# Altium schematic sheet EN_Boot_Buttons.SchDoc
size A; SheetNumber: 3; SheetTotal: 4
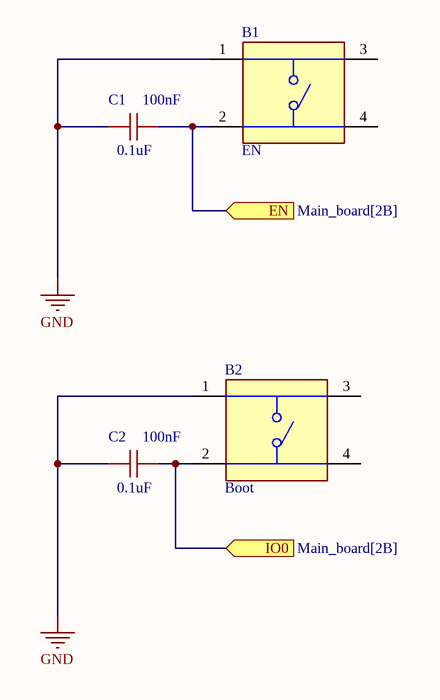
[diagram p0: EN_Boot_Buttons.SchDoc]

## Parts
B1  EN  [SW_TS04-66-43-BK-100-SMT]
B2  Boot  [SW_TS04-66-43-BK-100-SMT]
C1  100nF  [CAPC2013X140X45ML15T25]
C2  100nF  [CAPC2013X140X45ML15T25]

## Ports
EN (in, see Main_board[2B]), IO0 (in, see Main_board[2B])

## Nets
GND: B1.1 B2.1 C1.1 C2.1
EN: B1.2 C1.2 ; port EN
IO0: B2.2 C2.2 ; port IO0

Not connected (* = marked no-connect by the designer): B1 3 4; B2 3 4

## Notes on the sheet
- (in symbol GCM21BR71E104KA37L) 0.1uF

## Library data of the parts
B1 B2 = TS04-66-50-BK-160-SMT-TR_1: 6 x 6 mm, 5 mm Actuator Height, 160 gf, Black, Surface Mount, SPST, Tactile Switch; Manufacturer: Same Sky; Number of Positions: 2; Supplier: DigiKey; Supplier Part Number: 2223-TS04-66-50-BK-160-SMT-TR-ND; Manufacturer Part Number: TS04-66-50-BK-160-SMT-TR; RoHS: Compliant; Category: Tactile Switches; Pricing: 5000=0.10735 (USD); Lifecycle Status: Production; REACH SVHC: Yes; ComponentLink1URL: https://datasheet.octopart.com:443/TS04-66-50-BK-160-SMT-TR-Same-Sky-datasheet-183540778.pdf?src-supplier=Same+Sky; ComponentLink1Description: https://datasheet.octopart.com:443/TS04-66-50-BK-160-SMT-TR-Same-Sky-datasheet-183540778.pdf?src-supplier=Same+Sky; ComponentLink2URL: https://datasheet.octopart.com:443/TS04-66-50-BK-160-SMT-TR-Same-Sky-datasheet-181920469.pdf?src-supplier=Same+Sky; ComponentLink2Description: https://datasheet.octopart.com:443/TS04-66-50-BK-160-SMT-TR-Same-Sky-datasheet-181920469.pdf?src-supplier=Same+Sky; ComponentLink3URL: https://datasheet.octopart.com:443/TS04-66-50-BK-160-SMT-TR-CUI-Devices-datasheet-175928975.pdf?src-supplier=Same+Sky; ComponentLink3Description: https://datasheet.octopart.com:443/TS04-66-50-BK-160-SMT-TR-CUI-Devices-datasheet-175928975.pdf?src-supplier=Same+Sky; ComponentLink4URL: https://datasheet.octopart.com:443/TS04-66-50-BK-160-SMT-TR-CUI-Devices-datasheet-155929909.pdf?src-supplier=Same+Sky; ComponentLink4Description: https://datasheet.octopart.com:443/TS04-66-50-BK-160-SMT-TR-CUI-Devices-datasheet-155929909.pdf?src-supplier=Same+Sky; ComponentLink5URL: https://datasheet.octopart.com:443/TS04-66-50-BK-160-SMT-TR-CUI-Devices-datasheet-180438940.pdf?src-supplier=IHS; ComponentLink5Description: https://datasheet.octopart.com:443/TS04-66-50-BK-160-SMT-TR-CUI-Devices-datasheet-180438940.pdf?src-supplier=IHS; ComponentLink6URL: https://datasheet.octopart.com:443/TS04-66-50-BK-160-SMT-TR-Same-Sky-datasheet-182881590.pdf?src-supplier=Master+Electronics; ComponentLink6Description: https://datasheet.octopart.com:443/TS04-66-50-BK-160-SMT-TR-Same-Sky-datasheet-182881590.pdf?src-supplier=Master+Electronics; ComponentLink7URL: https://datasheet.octopart.com:443/TS04-66-50-BK-160-SMT-TR-Same-Sky-datasheet-189105765.pdf?src-supplier=Master+Electronics; ComponentLink7Description: https://datasheet.octopart.com:443/TS04-66-50-BK-160-SMT-TR-Same-Sky-datasheet-189105765.pdf?src-supplier=Master+Electronics; ComponentLink8URL: https://datasheet.octopart.com:443/TS04-66-50-BK-160-SMT-TR-Same-Sky-datasheet-188930959.pdf?src-supplier=TME; ComponentLink8Description: https://datasheet.octopart.com:443/TS04-66-50-BK-160-SMT-TR-Same-Sky-datasheet-188930959.pdf?src-supplier=TME; ComponentLink9URL: https://octopart.com:443/opatz8j6/c1?t=AHJHVxjaiIDIr6H_ItDqsJeDJqxcW_gJHqcHV2sr14xMipfx-HDzg_f0vkasGYHy5q-Btyt4jzHIYsIXAp8M-MkPAGFwjUVKwjpKunO9EjmQ9NoVu9p4HWs04ZXCmleWgcsYh-4RxiTzSsoULU2T2rz17cMXYYLK9_ziMcA7OGPXXbacYiPMCPpI60niI4dc0C9vNkjd65Jl5QkLrYSw83J7uaIpN8OeAtGX54ooF_yVEqS3W8UGSl3Fipt3e-uZfnOteh1ynDY5inV3vA_T2G7-jmG30-JmWZ9wvWQwyL_V03hDFAcYksLWHd1aRsOPWTbxvmd88SKpkAjFm5xu5x-cK5AUD6xUpAL7lh0xeIYzTPI4ZOg&src-supplier=Compliance+Statements; ComponentLink9Description: https://octopart.com:443/opatz8j6/c1?t=AHJHVxjaiIDIr6H_ItDqsJeDJqxcW_gJHqcHV2sr14xMipfx-HDzg_f0vkasGYHy5q-Btyt4jzHIYsIXAp8M-MkPAGFwjUVKwjpKunO9EjmQ9NoVu9p4HWs04ZXCmleWgcsYh-4RxiTzSsoULU2T2rz17cMXYYLK9_ziMcA7OGPXXbacYiPMCPpI60niI4dc0C9vNkjd65Jl5QkLrYSw83J7uaIpN8OeAtGX54ooF_yVEqS3W8UGSl3Fipt3e-uZfnOteh1ynDY5inV3vA_T2G7-jmG30-JmWZ9wvWQwyL_V03hDFAcYksLWHd1aRsOPWTbxvmd88SKpkAjFm5xu5x-cK5AUD6xUpAL7lh0xeIYzTPI4ZOg&src-supplier=Compliance+Statements; ComponentLink10URL: https://octopart.com:443/opatz8j6/c1?t=r1RK5IYUaob_85_1MSHGNq720LrhxWIvMn5DWdcJs86yyX1sCCzkutHExn9MWrIEn17t5vGoIZESqBBoujGJDEtnxSOKhQoF_HVCF4IjS0uNejDB1Hl06RViT7vLEqlS2nwCB_zZjOM2FBR17Cn3AygDXFz4irEFvfs5L25X4mfGCJscXkgX4qD28LidoQEhTj1XIrzkPBX_u6sUrCtXeGFsnQuDshvHBQ8JL4sZA9KNYQB46zrK0ZjbAVBq3PHdFimw1lZsdT1205N9iIZQ-sSyoeN1xzltvm_fFJtkrMx3uypwSCqRIIazHEyIss7CzzZHpr8HJ3IPX8N9BpeGudVq5MGf4iJVtCZae_yLFL5H-ssn_Jcg6fiM&src-supplier=Compliance+Statements; ComponentLink10Description: https://octopart.com:443/opatz8j6/c1?t=r1RK5IYUaob_85_1MSHGNq720LrhxWIvMn5DWdcJs86yyX1sCCzkutHExn9MWrIEn17t5vGoIZESqBBoujGJDEtnxSOKhQoF_HVCF4IjS0uNejDB1Hl06RViT7vLEqlS2nwCB_zZjOM2FBR17Cn3AygDXFz4irEFvfs5L25X4mfGCJscXkgX4qD28LidoQEhTj1XIrzkPBX_u6sUrCtXeGFsnQuDshvHBQ8JL4sZA9KNYQB46zrK0ZjbAVBq3PHdFimw1lZsdT1205N9iIZQ-sSyoeN1xzltvm_fFJtkrMx3uypwSCqRIIazHEyIss7CzzZHpr8HJ3IPX8N9BpeGudVq5MGf4iJVtCZae_yLFL5H-ssn_Jcg6fiM&src-supplier=Compliance+Statements; ComponentLink11URL: https://octopart.com:443/opatz8j6/c1?t=3BD6yHY4TMlPV1HdH1DfP3VwhdawlDk5uvE--lE0_OK2pMAHtXMzIWognZT8Kptg4hg-lGvkc8pM6295M0wnT2xUdro5X27lLiJF0vFSPDXW_Zl-47ruo4eQI3juyTTFsaQzGMRqd6HKVavC7jLqvg3e4wdyFRwHDNXvJFlQdNWuFbKytLsG4A2-4ydZK6E80O1irTcqN9MKGvI5XzA0YOv-CaSdIebfUu8zXvQJfIAIYzNrnKqCZgH7inlQIWZHKFLA1siN4vk2QxKmFGOy5iNd7qtG1c_EzzRGUuEk66hak1i00a4FRPnHP1sGNuLupUBDn3O7toNEWVdlsVQMt_vgglZqqjFBUsOjgP800DIecR_OMlE&src-supplier=Compliance+Statements; ComponentLink11Description: https://octopart.com:443/opatz8j6/c1?t=3BD6yHY4TMlPV1HdH1DfP3VwhdawlDk5uvE--lE0_OK2pMAHtXMzIWognZT8Kptg4hg-lGvkc8pM6295M0wnT2xUdro5X27lLiJF0vFSPDXW_Zl-47ruo4eQI3juyTTFsaQzGMRqd6HKVavC7jLqvg3e4wdyFRwHDNXvJFlQdNWuFbKytLsG4A2-4ydZK6E80O1irTcqN9MKGvI5XzA0YOv-CaSdIebfUu8zXvQJfIAIYzNrnKqCZgH7inlQIWZHKFLA1siN4vk2QxKmFGOy5iNd7qtG1c_EzzRGUuEk66hak1i00a4FRPnHP1sGNuLupUBDn3O7toNEWVdlsVQMt_vgglZqqjFBUsOjgP800DIecR_OMlE&src-supplier=Compliance+Statements; ComponentLink12URL: https://octopart.com:443/opatz8j6/c1?t=K3camy5c4Ucy_9yJ3KoVII-gY7VkFhW7P0bbZ5t4-ZUOrBjcTQp1Z0CfWV0BYFVb-fHwcr_lEptVhsKeusTQzSTvOQJoYc4MNj1Xi9Ce_YgscQjK650kyvQ9iLNiSq5mGOGzGFNePsfH6U4F6nSSG09sMoZOKXesSp3A9fEB81Ryg-V7UjN_ervOIvTSSU2pt4tfCkzqxWFsAWFQreVmjyuPQN_MUGuEn3zVyQx51WI-SEu-6b7QOUpGr0zjb-yB96bbP6EohUbR0VIhPKN-WK5D9Ild7BKF3VkdDbQsJZ5I28NoVyQVl5xozYnhRN5Qb2QQksLBhOvdnNRmi85i763lg0Pnr8-dc4-8tEY2vuhnMptderCnXY8-&src-supplier=Compliance+Statements; ComponentLink12Description: https://octopart.com:443/opatz8j6/c1?t=K3camy5c4Ucy_9yJ3KoVII-gY7VkFhW7P0bbZ5t4-ZUOrBjcTQp1Z0CfWV0BYFVb-fHwcr_lEptVhsKeusTQzSTvOQJoYc4MNj1Xi9Ce_YgscQjK650kyvQ9iLNiSq5mGOGzGFNePsfH6U4F6nSSG09sMoZOKXesSp3A9fEB81Ryg-V7UjN_ervOIvTSSU2pt4tfCkzqxWFsAWFQreVmjyuPQN_MUGuEn3zVyQx51WI-SEu-6b7QOUpGr0zjb-yB96bbP6EohUbR0VIhPKN-WK5D9Ild7BKF3VkdDbQsJZ5I28NoVyQVl5xozYnhRN5Qb2QQksLBhOvdnNRmi85i763lg0Pnr8-dc4-8tEY2vuhnMptderCnXY8-&src-supplier=Compliance+Statements
C1 C2 = GCM21BR71E104KA37L: Ceramic Capacitor, Ceramic, 25V, 10% +Tol, 10% -Tol, X7R, 15% TC, 0.1uF, Surface Mount, 0805; Manufacturer: Murata; Manufacturer Lifecycle Status: NRND; Supplier: DigiKey; Supplier Part Number: 490-14779-1-ND; Manufacturer Part Number: GCM21BR71E104KA37L; RoHS: Compliant; Category: Ceramic Capacitors; Stock: 12316; Pricing: 1=0.35, 10=0.208, 50=0.1528, 100=0.1358, 500=0.10726, 1000=0.09846 (USD); Value: 100nF; Case/Package: 0805; Case Code (Imperial): 0805; Case Code (Metric): 2012; Depth: 1.25mm; Dielectric: X7R; Dielectric Material: Ceramic; Height: 1.25mm; Length: 2mm; Lifecycle Status: NRND; Max Operating Temperature: 125°C; Min Operating Temperature: -55°C; Mounting Technology: Surface Mount; Number of Terminals: 2; Radiation Hardening: No; Ratings: AEC-Q200; REACH SVHC: Yes; Schedule B: 8532240020, 8532240020|8532240020|8532240020|8532240020|8532240020; Termination: SMD/SMT; Tolerance: 10%; Voltage Rating: 25V; Voltage Rating (DC): 25V; Width: 1.25mm; ComponentLink1URL: https://datasheet.octopart.com:443/GCM21BR71E104KA37L-Murata-datasheet-141268656.pdf?src-supplier=Geoflip; ComponentLink1Description: https://datasheet.octopart.com:443/GCM21BR71E104KA37L-Murata-datasheet-141268656.pdf?src-supplier=Geoflip; ComponentLink2URL: https://datasheet.octopart.com:443/GCM21BR71E104KA37L-Murata-datasheet-140660253.pdf?src-supplier=Ciiva; ComponentLink2Description: https://datasheet.octopart.com:443/GCM21BR71E104KA37L-Murata-datasheet-140660253.pdf?src-supplier=Ciiva; ComponentLink3URL: https://datasheet.octopart.com:443/GCM21BR71E104KA37L-Murata-datasheet-138719617.pdf?src-supplier=Ciiva; ComponentLink3Description: https://datasheet.octopart.com:443/GCM21BR71E104KA37L-Murata-datasheet-138719617.pdf?src-supplier=Ciiva; ComponentLink4URL: https://datasheet.octopart.com:443/GCM21BR71E104KA37L-Murata-datasheet-128592896.pdf?src-supplier=X-ON; ComponentLink4Description: https://datasheet.octopart.com:443/GCM21BR71E104KA37L-Murata-datasheet-128592896.pdf?src-supplier=X-ON; ComponentLink5URL: https://datasheet.octopart.com/GCM21BR71E104KA37L-Murata-datasheet-14404970.pdf; ComponentLink5Description: https://datasheet.octopart.com/GCM21BR71E104KA37L-Murata-datasheet-14404970.pdf; ComponentLink6URL: http://sigma.octopart.com:80/reach_statement/Murata-company-16.pdf?src-supplier=Compliance+Statements; ComponentLink6Description: http://sigma.octopart.com:80/reach_statement/Murata-company-16.pdf?src-supplier=Compliance+Statements